# EAGLE design scan (EAGLE 7.6.0)
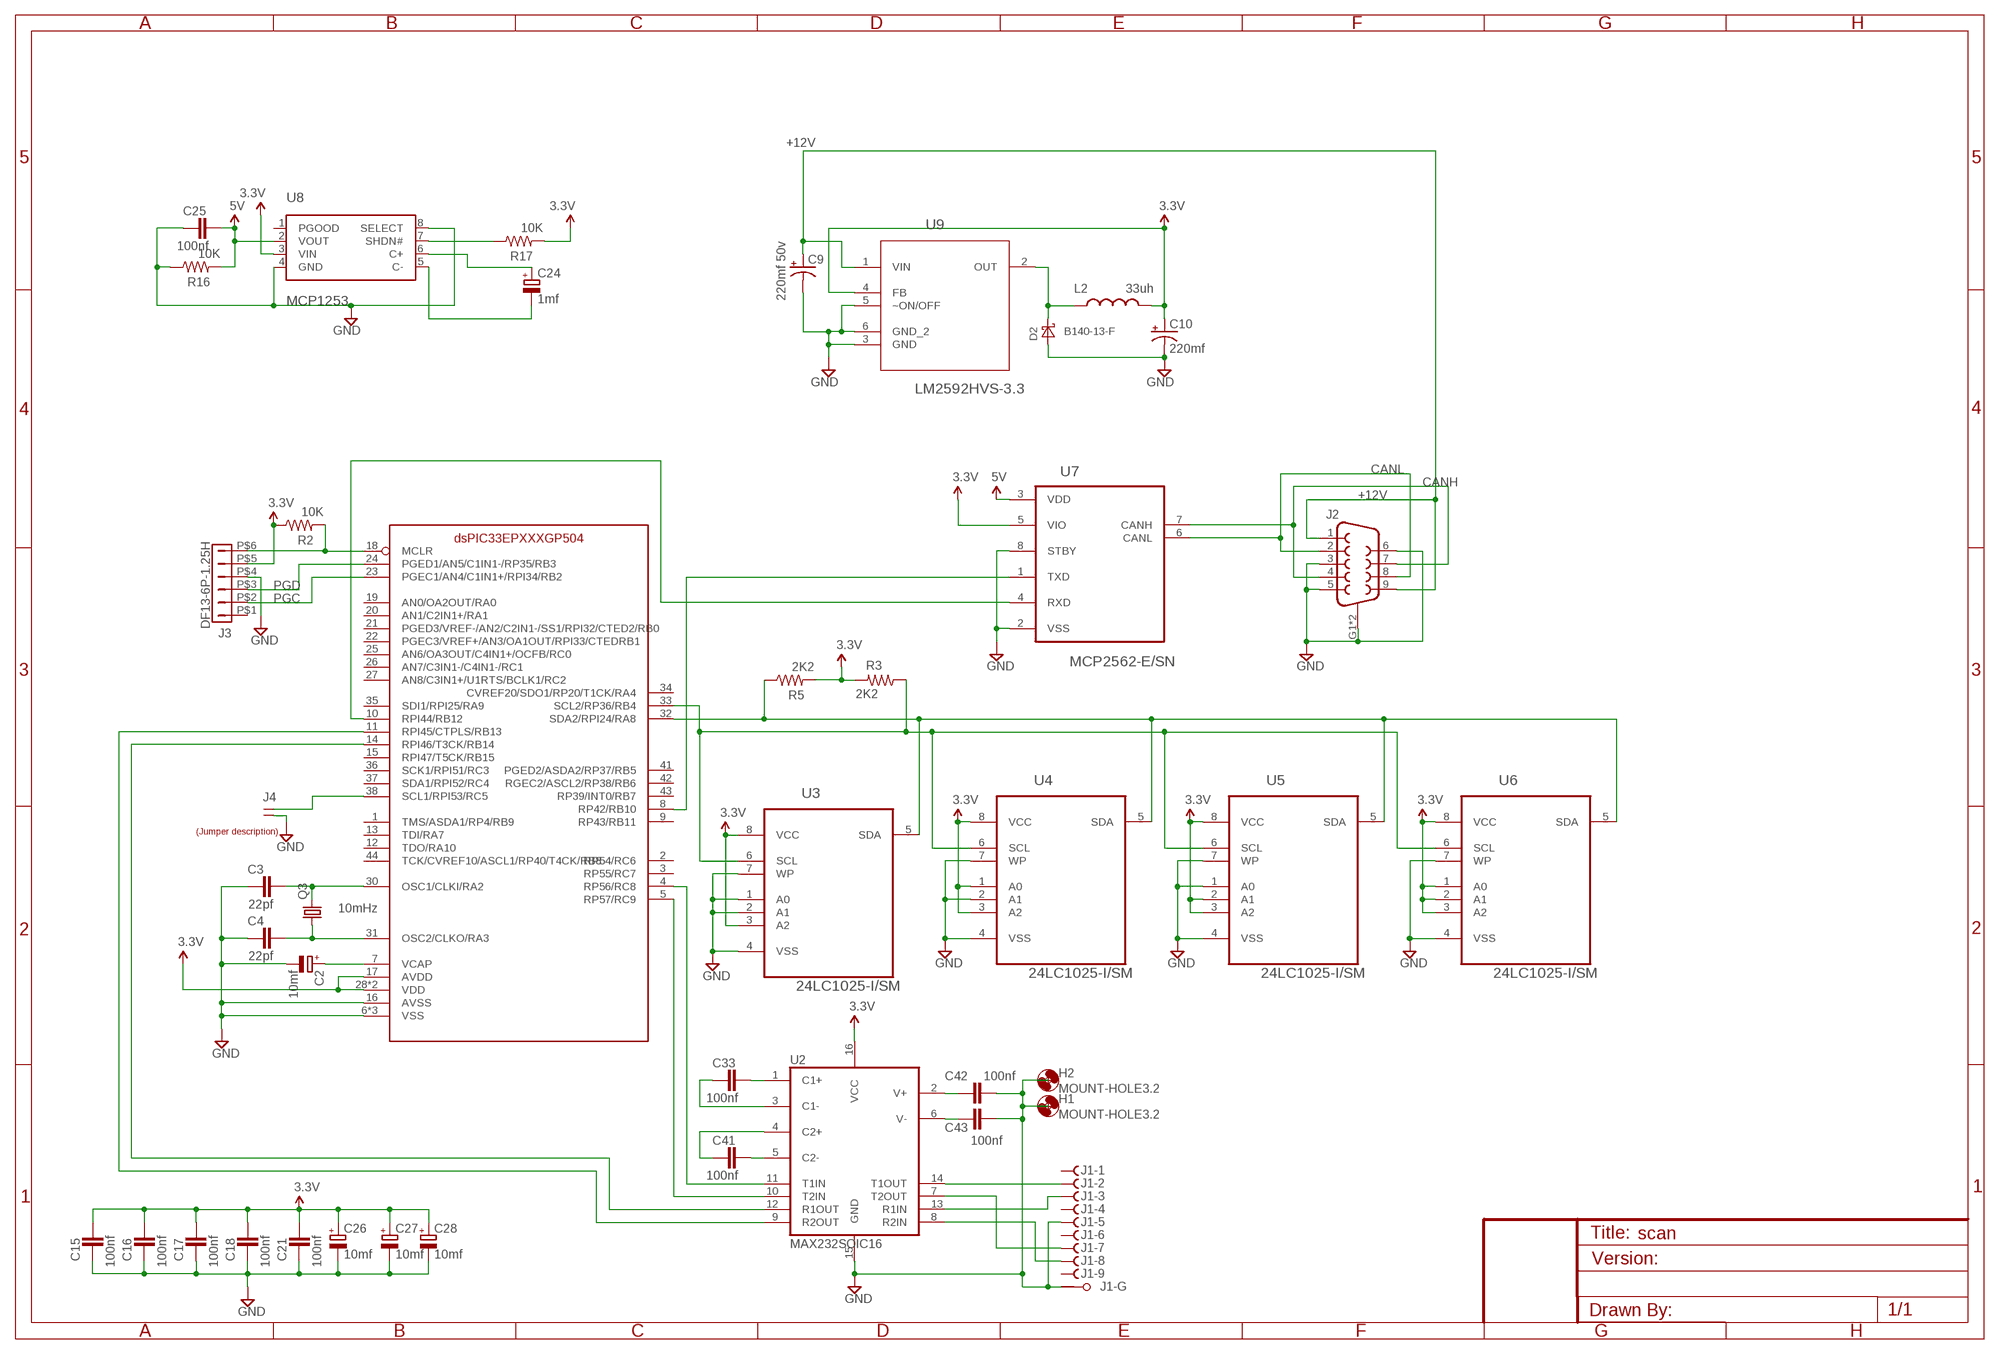
[diagram p0: schematic, sheet 1]

## Parts
C2  10mf  CAPACITOR_POL-SMC_A  [SMC_A]
C3  22pf  CAPACITOR_NPOL-0805  [C805]
C4  22pf  CAPACITOR_NPOL-0805  [C805]
C9  220mf 50v  CAP_POL7343  [EIA7343]
C10  220mf  CAP_POL7343  [EIA7343]
C15  100nf  CAPACITOR_NPOL-0805  [C805]
C16  100nf  CAPACITOR_NPOL-0805  [C805]
C17  100nf  CAPACITOR_NPOL-0805  [C805]
C18  100nf  CAPACITOR_NPOL-0805  [C805]
C21  100nf  CAPACITOR_NPOL-0805  [C805]
C24  1mf  CAPACITOR_POL-SMC_A  [SMC_A]
C25  100nf  CAPACITOR_NPOL-0805  [C805]
C26  10mf  CAPACITOR_POL-SMC_A  [SMC_A]
C27  10mf  CAPACITOR_POL-SMC_A  [SMC_A]
C28  10mf  CAPACITOR_POL-SMC_A  [SMC_A]
C33  100nf  CAPACITOR_NPOL-0805  [C805]
C41  100nf  CAPACITOR_NPOL-0805  [C805]
C42  100nf  CAPACITOR_NPOL-0805  [C805]
C43  100nf  CAPACITOR_NPOL-0805  [C805]
D2  B140-13-F  DIODE-SCHOTTKY-SMA  [SMA]
H1  MOUNT-HOLE3.2  [3,2]
H2  MOUNT-HOLE3.2  [3,2]
J1  F09VPS  [F09VP]
J2  DB9FEMALE  [DB9]
J3  DF13-6P-1.25H  [DF13A-6P-1.25H]
J4  JUMPER-1X2  [JUMPER-1X2]
L2  33uh  INDUCTOR  [1812]
Q3  10mHz  CRYSTALHC49S  [HC49/S]
R2  10K  RESISTOR0603-RES  [0603-RES]
R3  2K2  RESISTOR0603-RES  [0603-RES]
R5  2K2  RESISTOR0603-RES  [0603-RES]
R16  10K  RESISTOR0603-RES  [0603-RES]
R17  10K  RESISTOR0603-RES  [0603-RES]
U1  DSPIC33EPXXXGP504  [TQFP44]
U2  MAX232SOIC16  [SO016]
U3  24LC1025-I/SM  [SOIC8-N_MC]
U4  24LC1025-I/SM  [SOIC8-N_MC]
U5  24LC1025-I/SM  [SOIC8-N_MC]
U6  24LC1025-I/SM  [SOIC8-N_MC]
U7  MCP2562-E/SN  [SOIC-8N]
U8  MCP1253  [MSOP8]
U9  LM2592HVS-3.3  LM2592HVS-5.0  [TO170P1435X457-5N]
U$1  LABEL_JUMPER_1X2  [JUMP2_DESC]

## Nets
3.3V: C10.A(+) C15.1 C16.1 C17.1 C18.1 C21.1 C26.+ C27.+ C28.+ J3.P$5 L2.2 R2.1 R3.2 R5.2 R17.2 U1.17(AVDD) U1.28(VDD) U1.40(VDD) U2.16(VCC) U3.3(A2) U3.8(VCC) U4.1(A0) U4.3(A2) U4.8(VCC) U5.2(A1) U5.3(A2) U5.8(VCC) U6.1(A0) U6.2(A1) U6.3(A2) U6.8(VCC) U7.5(VIO) U8.3(VIN) U9.4(FB)
5V: C25.1 R16.2 U7.3(VDD) U8.2(VOUT)
!MCLR: J3.P$6 R2.2 U1.18(MCLR)
+12V [12v]: C9.A(+) J2.1 J2.9 U9.1(VIN)
CANH: J2.4 J2.7 U7.7(CANH)
CANL: J2.2 J2.8 U7.6(CANL)
GND: C2.- C3.2 C4.2 C9.C(-) C10.C(-) C15.2 C16.2 C17.2 C18.2 C21.2 C25.2 C26.- C27.- C28.- C42.1 C43.1 D2.A J1.5(-5:F) J1.G1(-G:G1) J2.3 J2.5 J2.6 J2.G1(SHIELD) J2.G2(SHIELD) J3.P$4 J4.2 R16.1 U1.6(VSS) U1.16(AVSS) U1.29(VSS) U1.39(VSS) U2.15(GND) U3.1(A0) U3.2(A1) U3.4(VSS) U3.7(WP) U4.2(A1) U4.4(VSS) U4.7(WP) U5.1(A0) U5.4(VSS) U5.7(WP) U6.4(VSS) U6.7(WP) U7.2(VSS) U7.8(STBY) U8.4(GND) U8.8(SELECT) U9.3(GND) U9.5(~ON/OFF) U9.6(GND_2)
N$1: J1.2(-2:F) U2.14(T1OUT)
N$2: U1.5(RP57/RC9) U2.10(T2IN)
N$3: U1.4(RP56/RC8) U2.11(T1IN)
N$4: J1.3(-3:F) U2.13(R1IN)
N$5: J1.8(-8:F) U2.8(R2IN)
N$6: J1.7(-7:F) U2.7(T2OUT)
N$7: U1.11(RPI45/CTPLS/RB13) U2.9(R2OUT)
N$8: U1.14(RPI46/T3CK/RB14) U2.12(R1OUT)
N$14: C33.1 U2.1(C1+)
N$18: C33.2 U2.3(C1-)
N$19: C3.1 Q3.2 U1.30(OSC1/CLKI/RA2)
N$21: C41.2 U2.4(C2+)
N$22: C41.1 U2.5(C2-)
N$23: D2.C L2.1 U9.2(OUT)
N$24: U1.10(RPI44/RB12) U7.4(RXD)
N$25: C2.+ U1.7(VCAP)
N$26: U1.8(RP42/RB10) U7.1(TXD)
N$27: C42.2 U2.2(V+)
N$28: C43.2 U2.6(V-)
N$30: J4.1 U1.38(SCL1/RPI53/RC5)
N$36: R17.1 U8.7(SHDN#)
N$37: C24.- U8.5(C-)
N$38: C24.+ U8.6(C+)
N$70: C4.1 Q3.1 U1.31(OSC2/CLKO/RA3)
PGC: J3.P$2 U1.23(PGEC1/AN4/C1IN1+/RPI34/RB2)
PGD: J3.P$3 U1.24(PGED1/AN5/C1IN1-/RP35/RB3)
SCL: R3.1 U1.33(SCL2/RP36/RB4) U3.6(SCL) U4.6(SCL) U5.6(SCL) U6.6(SCL)
SDA: R5.1 U1.32(SDA2/RPI24/RA8) U3.5(SDA) U4.5(SDA) U5.5(SDA) U6.5(SDA)
Unconnected: J1.1(-1:F) J1.4(-4:F) J1.6(-6:F) J1.9(-9:F) J1.G2(-G:G2) J3.P$1 U1.1(TMS/ASDA1/RP4/RB9) U1.2(RP54/RC6) U1.3(RP55/RC7) U1.9(RP43/RB11) U1.12(TDO/RA10) U1.13(TDI/RA7) U1.15(RPI47/T5CK/RB15) U1.19(AN0/OA2OUT/RA0) U1.20(AN1/C2IN1+/RA1) U1.21(PGED3/VREF-/AN2/C2IN1-/SS1/RPI32/CTED2/RB0) U1.22(PGEC3/VREF+/AN3/OA1OUT/RPI33/CTEDRB1) U1.25(AN6/OA3OUT/C4IN1+/OCFB/RC0) U1.26(AN7/C3IN1-/C4IN1-/RC1) U1.27(AN8/C3IN1+/U1RTS/BCLK1/RC2) U1.34(CVREF20/SDO1/RP20/T1CK/RA4) U1.35(SDI1/RPI25/RA9) U1.36(SCK1/RPI51/RC3) U1.37(SDA1/RPI52/RC4) U1.41(PGED2/ASDA2/RP37/RB5) U1.42(RGEC2/ASCL2/RP38/RB6) U1.43(RP39/INT0/RB7) U1.44(TCK/CVREF10/ASCL1/RP40/T4CK/RB8) U8.1(PGOOD)

## Library data of the parts
C2 C26-C28 = dp_devices:CAPACITOR_POL: Polarized capacitor in various packages; PARTNO: T491A106K004AT
C3 C4 = dp_devices:CAPACITOR_NPOL: Non-Polarized capacitor in various packages; PARTNO: C0805C220J5GACTU
C9 C10 = SparkFun:CAP_POL: Capacitor Polarized These are standard SMD and PTH capacitors. Normally 10uF, 47uF, and 100uF in electrolytic and tantalum varieties. Always verify the external diameter of the through hole cap, it varies with capacity, voltage, and manufacturer. The EIA devices should be standard.; PARTNO: T545X227M016ATE035
C15-C18 C21 C25 C33 C41-C43 = dp_devices:CAPACITOR_NPOL: Non-Polarized capacitor in various packages; PARTNO: CL21F104ZBCNNNC
C24 = dp_devices:CAPACITOR_POL: Polarized capacitor in various packages; PARTNO: F931C105MAA
D2 = diode2:DIODE-SCHOTTKY-: SCHOTTKY DIODE; PARTNO: B140-13-F
H1 H2 = holes:MOUNT-HOLE: MOUNTING HOLE with drill center marker
J1 = con-subd:F09VPS: SUB-D; OC_FARNELL: unknown; OC_NEWARK: unknown; PARTNO: 3-1634222-2
J2 = 15pinD:DB9: DB9 Connector Standard DB9 (D-Sub 9) serial connector. Can be used for CAN bus as well as RS485 and RS232. Footprint production proven. Spark Fun Electronics SKU : PRT-00429; PARTNO: 1734354-2; PROD_ID: CONN-08194
J3 = con-hirose-df13:DF13-6P-1.25: DF13-6P 1.25mm Pitch Miniature Crimping Connector.; PARTNO: DF13A-6P-1.25H(20)
J4 = QuantumOptics:JUMPER-1X2: Jumper, header, SIP on 0.1" grid, for option selection.; PARTNO: M20-9770246
L2 = SparkFun:INDUCTOR: Inductors Basic Inductor/Choke - 0603 and 1206. Footprints are not proven and vary greatly between part numbers.; PARTNO: LQH43MN330K03L
Q3 = crystal:CRYSTAL: CRYSTAL; OC_FARNELL: 1667008; OC_NEWARK: unknown; PARTNO: ATS100B-E
R2 R16 R17 = SparkFun-Passives:RESISTOR: Resistor Basic schematic elements and footprints for 0603, 1206, and PTH resistors.; PARTNO: RC0603FR-0710KL
R3 R5 = SparkFun-Passives:RESISTOR: Resistor Basic schematic elements and footprints for 0603, 1206, and PTH resistors.; PARTNO: RC0603FR-072K2L
U1 = microchip-dspic:DSPIC33EPXXXGP504; PARTNO: DSPIC33EP512GP504-I/PT
U2 = SparkFun:MAX232: RS232 Transceiver Very common IC. This is generically called 'MAX232', but works with the 3V equivalent MAX3232 generic ICs. Field tested and mother approved. Spark Fun Electronics SKU : COM-00316 (DIP) and COM-00589 (SMD); PARTNO: MAX3232ECDR
U3-U6 = Microchip_By_element14_Batch_1:24LC1025-I/SM: 1024K I2C CMOS Serial EEPROM; PARTNO: 24LC1025T-I/SN
U7 = Microchip-MCP2562-E_SN:MCP2562-E/SN: High-Speed CAN Transceiver,SOIC-8; PARTNO: MCP2562-E/SN
U8 = microchip-dspic:MCP1253: Positive-Regulated Charge Pump (3.3x5.0); PARTNO: MCP1253-33X50I/MS
U9 = NSC_By_element14_Batch_1.1:LM2592HVS-5.0: SIMPLE SWITCHER; MPN: LM2592HVS-5.0; OC_FARNELL: -; OC_NEWARK: 41K3791; PACKAGE: TO-263-5; PARTNO: LM2592HVSX-3.3/NOPB; SUPPLIER: National Semiconductor
U$1 = dp_devices:LABEL_JUMPER_1X2: Nice formatted two legged jumperdescription Use attributes to change the values ON = With jumper OFF = Without jumper; OFF: Normal; ON: Reset

## Net classes
2 12v: width 0.152 mm, drill 0.305 mm, clearance 0.305 mm

## Board
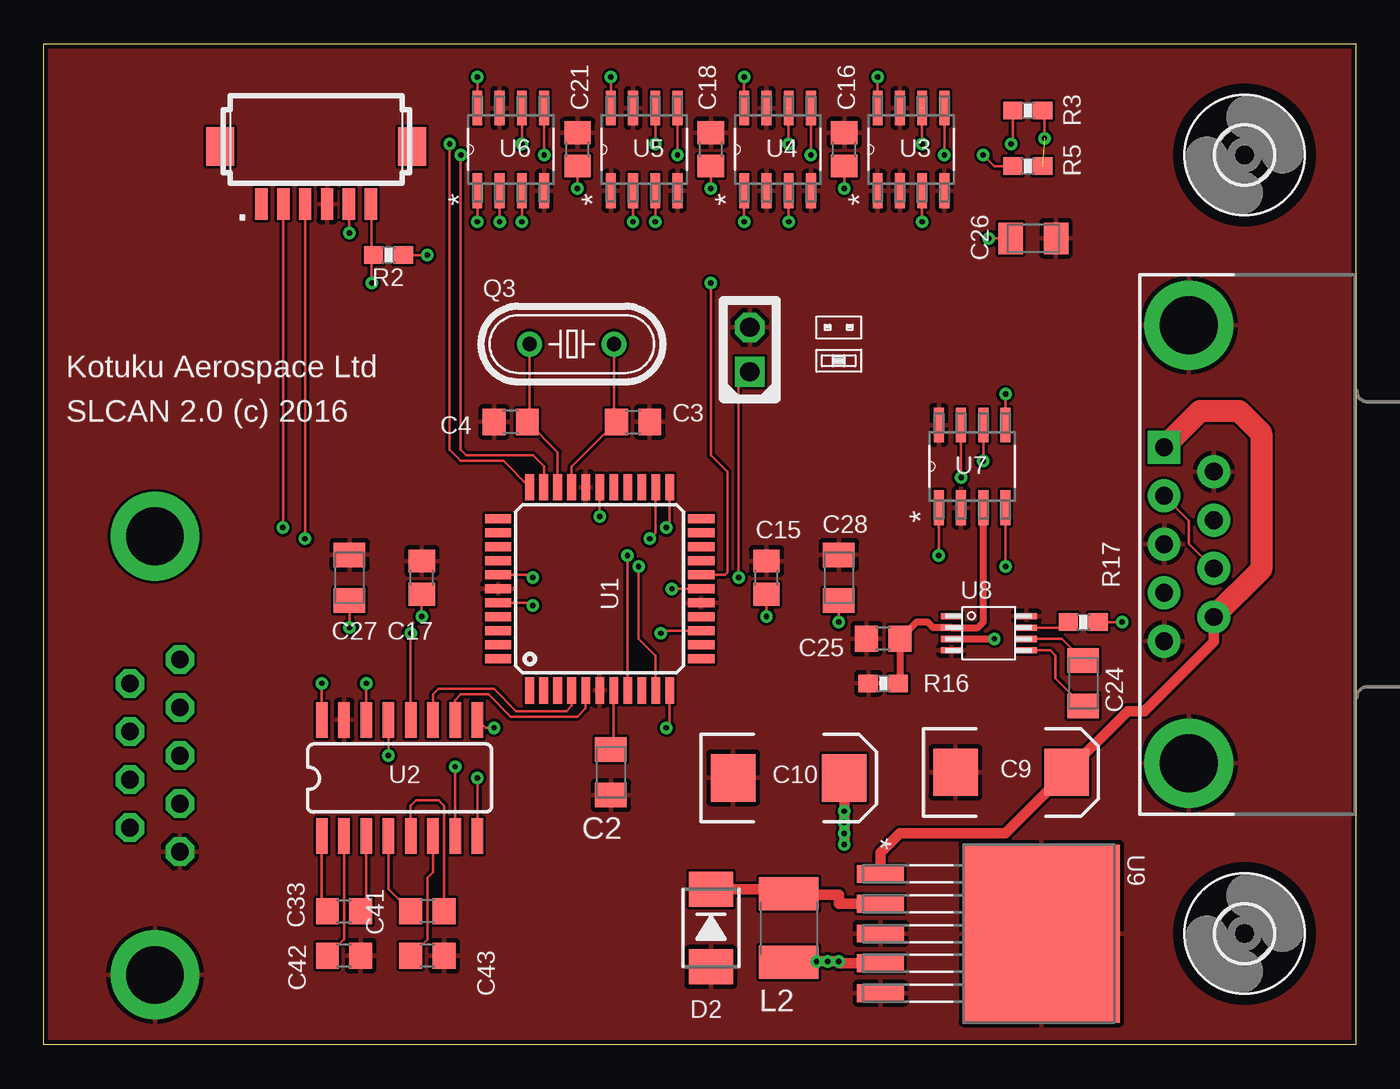
[diagram p1: board, top side]
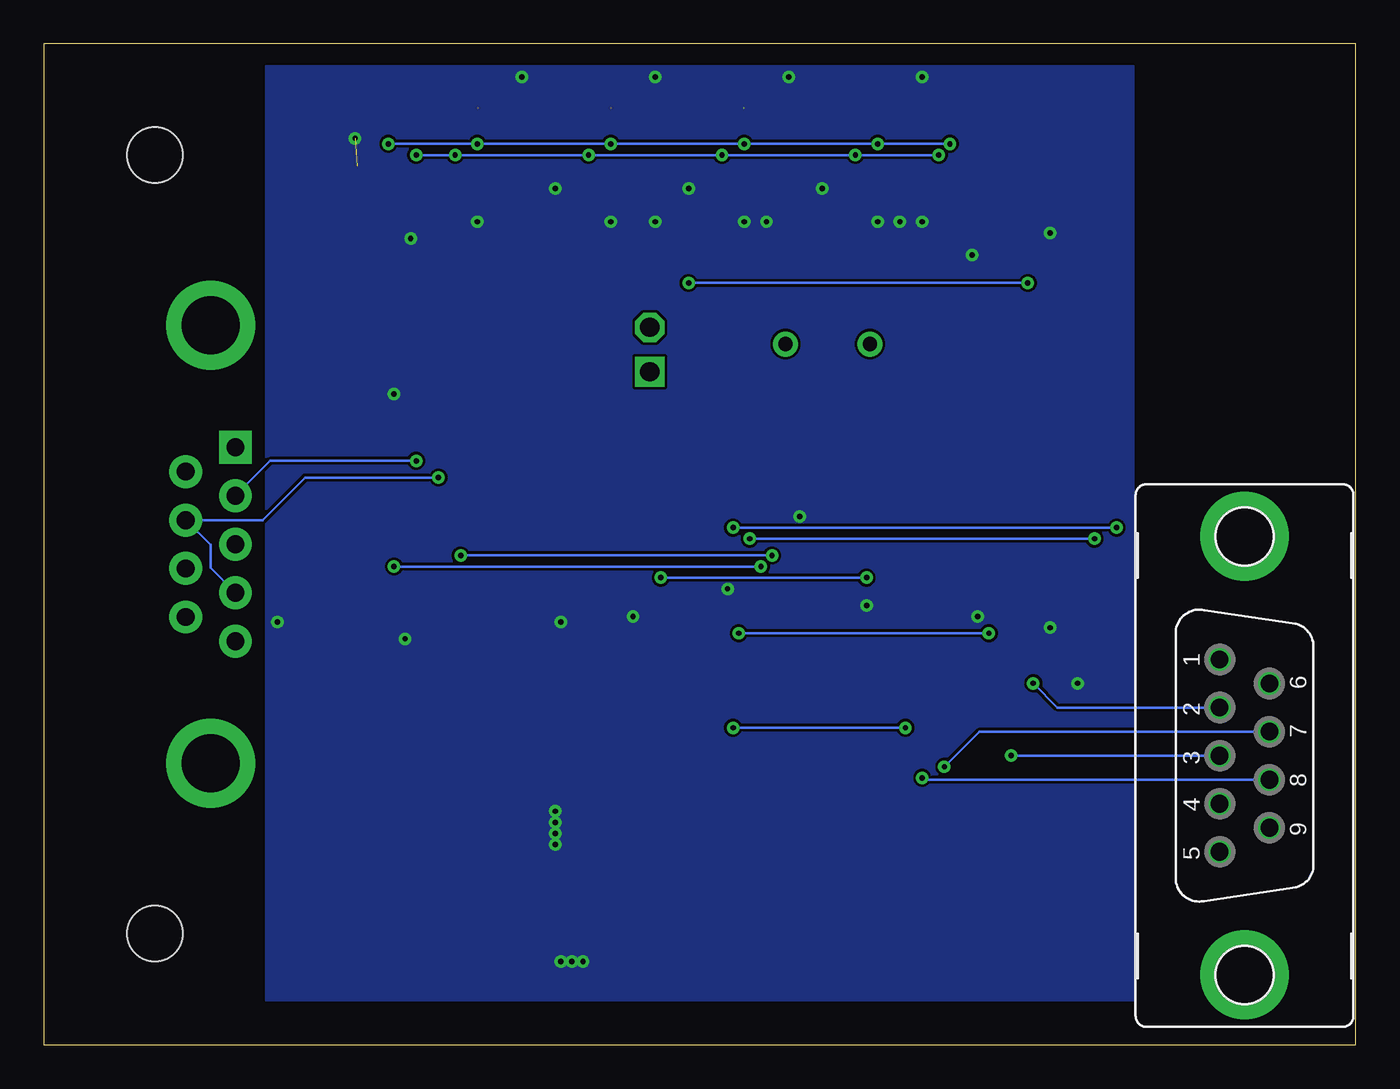
[diagram p2: board, bottom side, seen from below]

Size 74.93 x 57.15 mm. Coordinates in mm from the lower left corner, seen from the top.
Outline: 0,0 0,57.15 74.93,57.15 74.93,0 0,0
Copper layers (1*16): Top 0.035mm / dielectric 1.5mm / Bottom 0.035mm
Design rules "DFRobot_Eagle_Rule_v0.4": minimum track width 6mil, minimum drill 12mil, track to track 6mil, track to pad 6mil, pad to pad 6mil, via to via 6mil, smd to smd 0mil, copper to edge 10mil, drill to drill 10mil, minimum pad ring 12mil, minimum via ring 8mil, stop-mask expansion 2mil, vias tented up to drill 25mil, thermal gap 10mil

### Footprints (pad centres in the part's own frame; a part is rotated, then mirrored left to right if it is on the bottom)
SMC_A = smd 1.4 x 1.8: + -1.3,0; - 1.3,0
C805 = smd 1.3 x 1.5: 1 -0.95,0; 2 0.95,0
EIA7343 = smd 2.55 x 2.7: A 3.17,0; C -3.17,0
SMA = smd 2 x 2.5: A 2.223,0; C -2.223,0
3,2 = hole 3.2: 0,0
F09VP = drill 1.016 octagon: 1 5.486,1.422; 2 2.743,1.422; 3 0,1.422; 4 -2.743,1.422; 5 -5.486,1.422; 6 4.115,-1.422; 7 1.372,-1.422; 8 -1.372,-1.422; 9 -4.115,-1.422 | drill 3.302 pad 5.08: G1 -12.522,0; G2 12.522,0
DB9 = drill 1.016 pad 1.88 square: 1 -5.54,-1.42 | drill 1.016 pad 1.88: 2 -2.77,-1.42; 3 0,-1.42; 4 2.77,-1.42; 5 5.54,-1.42; 6 -4.15,1.42; 7 -1.38,1.42; 8 1.38,1.42; 9 4.15,1.42 | drill 3.302 pad 5.08: G1 -12.5,0; G2 12.5,0
DF13A-6P-1.25H = smd 1.6 x 2.2: M$0 -5.475,2.4; M$1 5.475,2.4 | smd 0.7 x 1.8: P$1 -3.125,-0.9; P$2 -1.875,-0.9; P$3 -0.625,-0.9; P$4 0.625,-0.9; P$5 1.875,-0.9; P$6 3.125,-0.9
JUMPER-1X2 = drill 1.092 square: 1 0,2.54 | drill 1.092 octagon: 2 0,0
1812 = smd 1.9 x 3.4: 1 -1.95,0; 2 1.95,0
HC49/S = drill 0.813: 1 -2.413,0; 2 2.413,0
0603-RES = smd 1.1 x 1: 1 -0.85,0; 2 0.85,0
TQFP44 = smd 1.5 x 0.5: 1 -5.8,4; 2 -5.8,3.2; 3 -5.8,2.4; 4 -5.8,1.6; 5 -5.8,0.8; 6 -5.8,0; 7 -5.8,-0.8; 8 -5.8,-1.6; 9 -5.8,-2.4; 10 -5.8,-3.2; 11 -5.8,-4; 23 5.8,-4; 24 5.8,-3.2; 25 5.8,-2.4; 26 5.8,-1.6; 27 5.8,-0.8; 28 5.8,0; 29 5.8,0.8; 30 5.8,1.6; 31 5.8,2.4; 32 5.8,3.2; 33 5.8,4 | smd 0.5 x 1.5: 12 -4,-5.8; 13 -3.2,-5.8; 14 -2.4,-5.8; 15 -1.6,-5.8; 16 -0.8,-5.8; 17 0,-5.8; 18 0.8,-5.8; 19 1.6,-5.8; 20 2.4,-5.8; 21 3.2,-5.8; 22 4,-5.8; 34 4,5.8; 35 3.2,5.8; 36 2.4,5.8; 37 1.6,5.8; 38 0.8,5.8; 39 0,5.8; 40 -0.8,5.8; 41 -1.6,5.8; 42 -2.4,5.8; 43 -3.2,5.8; 44 -4,5.8
SO016 = smd 0.66 x 2.032: 1 -4.445,-3.315; 2 -3.175,-3.315; 3 -1.905,-3.315; 4 -0.635,-3.315; 5 0.635,-3.315; 6 1.905,-3.315; 7 3.175,-3.315; 8 4.445,-3.315; 9 4.445,3.315; 10 3.175,3.315; 11 1.905,3.315; 12 0.635,3.315; 13 -0.635,3.315; 14 -1.905,3.315; 15 -3.175,3.315; 16 -4.445,3.315
SOIC8-N_MC = smd 1.981 x 0.559: 1 -2.362,1.905; 2 -2.362,0.635; 3 -2.362,-0.635; 4 -2.362,-1.905; 5 2.362,-1.905; 6 2.362,-0.635; 7 2.362,0.635; 8 2.362,1.905
SOIC-8N = smd 1.981 x 0.559: 1 1.448,5.715; 2 1.448,4.445; 3 1.448,3.175; 4 1.448,1.905; 5 6.172,1.905; 6 6.172,3.175; 7 6.172,4.445; 8 6.172,5.715
MSOP8 = smd 1.2 x 0.35: 1 -2.145,0.975; 2 -2.145,0.325; 3 -2.145,-0.325; 4 -2.145,-0.975; 5 2.145,-0.975; 6 2.145,-0.325; 7 2.145,0.325; 8 2.145,0.975
TO170P1435X457-5N = smd 1.016 x 2.692: 1 -3.404,-9.042; 2 -1.702,-9.042; 3 0,-9.042; 4 1.702,-9.042; 5 3.404,-9.042 | smd 10.16 x 8.941: 6 0,0.152

### Placement (x,y rotation side)
C2  32.38,15.56 270 top
C3  33.66,35.56 0 top
C4  26.67,35.56 180 top
C9  55.24,15.56 0 top
C10  42.55,15.24 0 top
C15  41.27,26.67 90 top
C16  45.72,51.12 90 top
C17  21.59,26.67 90 top
C18  38.1,51.12 90 top
C21  30.48,51.12 90 top
C24  59.37,20.64 270 top
C25  47.94,23.18 180 top
C26  56.52,46.04 0 top
C27  17.46,26.67 90 top
C28  45.4,26.67 90 top
C33  17.14,7.62 0 top
C41  21.91,7.62 180 top
C42  17.14,5.08 180 top
C43  21.91,5.08 180 top
D2  38.1,6.67 270 top
H1  68.58,50.8 0 top
H2  68.58,6.35 0 top
J1  6.35,16.51 90 bottom
J2  65.41,28.57 270 top
J3  15.56,48.9 0 top
J4  40.32,40.96 180 top
L2  42.55,6.67 270 top
Q3  30.16,40.01 0 top
R2  19.68,45.09 180 top
R3  56.2,53.34 0 top
R5  56.2,50.16 0 top
R16  47.94,20.64 0 top
R17  59.37,24.13 0 top
U1  31.75,26.04 90 top
U2  20.32,15.24 0 top
U3  49.53,51.12 90 top
U4  41.91,51.12 90 top
U5  34.29,51.12 90 top
U6  26.67,51.12 90 top
U7  56.83,29.21 90 top
U8  53.98,23.5 0 top
U9  56.83,6.35 270 top
U$1  47.94,39.69 0 top

### Tracks (layer width: path | path; a pad name or v marks a point on that pad's centre or on a via)
3.3V  (via drill 0.3)  (1 unrouted)
  Top 0.152: U1.40 27.94,25.23 v27.94,25.08 | U1.28 v31.75,30.16 | U1.17 v35.88,26.04 | C17.1 v21.59,24.45 | C27.+ v17.46,23.81 | U2.16 v15.88,20.64 | C15.1 v41.27,24.45 | C28.+ v45.4,24.13 | U6.8 v24.77,55.24 | U6.1 v24.77,46.99 | U6.2 v26.04,46.99 | U6.3 v27.3,46.99 | C21.1 v30.48,48.9 | U5.8 v32.38,55.24 | U5.2 v33.66,46.99 | U5.3 v34.92,46.99 | C18.1 v38.1,48.9 | U4.1 v40.01,46.99 | U4.8 v40.01,55.24 | U4.3 v42.55,46.99 | C16.1 v45.72,48.9 | U3.8 v47.62,55.24 | U3.3 v50.16,46.99 | R3.2 57.15,53.24 v57.15,51.75 | R5.2 57.15,50.16 | C26.+ v53.98,46.04 | U7.5 v54.93,37.15 | R17.2 v61.59,24.13 | U8.3 | R2.1 v21.91,45.09 | J3.P$5 17.43,46.38 v17.46,46.35
  Top 0.406: U8.3 v54.29,23.18
  Top 0.61: U9.4 45.4,4.65 v45.4,4.76 v44.77,4.76 v44.13,4.76 42.55,4.76 L2.2 | C10.A v45.72,13.34 v45.72,12.7 v45.72,12.06 v45.72,11.43
  pour Bottom: 12.7,55.88 62.23,55.88 62.23,2.54 12.7,2.54
5V
  Top 0.406: U7.3 53.66,24.13 53.35,23.82 U8.2 51.12,23.82 51.12,23.81 50.8,23.81 50.48,24.13 49.84,24.13 C25.1 48.89,20.74 R16.2
!MCLR  (via drill 0.3)
  Top 0.152: U1.18 38.9,26.84 39.05,26.99 39.05,32.7 38.1,33.66 v38.1,43.5 | v18.73,43.5 18.73,44.98 R2.2 18.73,45.19 18.73,47.94 J3.P$6
  Bottom 0.152: v38.1,43.5 v18.73,43.5
+12V
  Top 0.61: U9.1 47.79,10.96 48.9,12.06 54.92,12.06 C9.A 61.91,19.05 62.87,19.05 66.83,23.01 J2.9
  Top 1.27: J2.1 63.98,34.14 66.04,36.2 68.26,36.2 69.53,34.92 69.53,27.13 J2.9
CANH  (via drill 0.3)
  Top 0.152: U7.7 v52.39,32.38
  Bottom 0.152: J2.4 65.41,27.23 65.41,28.54 J2.7 62.44,29.95 60.01,32.38 v52.39,32.38
CANL  (via drill 0.3)
  Top 0.152: J2.2 65.41,29.93 65.41,28.61 J2.8 | U7.6 v53.66,33.34
  Bottom 0.152: v53.66,33.34 61.99,33.34 J2.2
GND
  pour Top: 0,57.15 74.93,57.15 74.93,0 0,0
N$1  (via drill 0.3)
  Top 0.152: v18.41,20.64 U2.14
  Bottom 0.152: J1.2 17.03,19.25 v18.41,20.64
N$2
  Top 0.152: U2.10 23.5,19.68 23.81,20 25.4,20 26.67,18.73 30.48,18.73 30.95,19.2 U1.5
N$3
  Top 0.152: U2.11 22.23,20 22.54,20.32 25.72,20.32 26.99,19.05 29.84,19.05 30.15,19.36 U1.4
N$4  (via drill 0.3)
  Top 0.152: v19.68,16.51 U2.13
  Bottom 0.152: J1.3 v19.68,16.51
N$5  (via drill 0.3)
  Top 0.152: v24.77,15.24 U2.8
  Bottom 0.152: J1.8 24.66,15.14 v24.77,15.24
N$6  (via drill 0.3)
  Top 0.152: v23.5,15.88 U2.7
  Bottom 0.152: J1.7 21.49,17.88 v23.5,15.88
N$7  (via drill 0.3)
  Top 0.152: U2.9 25.22,18.1 v25.72,18.1 | v35.56,18.1 35.75,18.29 U1.11
  Bottom 0.152: v25.72,18.1 v35.56,18.1
N$8  (via drill 0.3)
  Top 0.152: U2.12 v20.95,23.5 | v35.24,23.5 35.38,23.64 U1.14
  Bottom 0.152: v20.95,23.5 v35.24,23.5
N$14
  Top 0.152: U2.1 15.88,7.94 C33.1
N$18
  Top 0.152: U2.3 18.41,7.94 C33.2
N$19
  Top 0.152: Q3.2 32.58,35.69 C3.1 30.15,33.01 U1.30
N$21
  Top 0.152: U2.4 19.68,8.89 C41.2
N$22
  Top 0.152: U2.5 20.95,13.65 21.27,13.97 22.54,13.97 22.86,13.65 C41.1
N$23
  Top 0.61: U9.2 45.4,8.05 45.4,8.57 42.55,8.57 L2.1 42.55,8.89 D2.C
N$24  (via drill 0.3)
  Top 0.152: U1.10 34.95,22.2 33.97,23.18 v33.97,27.3 | v54.93,27.3 U7.4
  Bottom 0.152: v33.97,27.3 v54.93,27.3
N$25
  Top 0.152: C2.+ 32.55,17.02 U1.7
N$26  (via drill 0.3)
  Top 0.152: U1.8 33.35,27.93 v33.34,27.94 | v51.12,27.94 U7.1
  Bottom 0.152: v33.34,27.94 v51.12,27.94
N$27
  Top 0.152: U2.2 17.14,6.03 C42.2
N$28
  Top 0.152: U2.6 22.23,9.84 21.91,9.53 21.91,6.03 C43.2
N$30  (via drill 0.3)
  Top 0.152: U1.38 27.77,26.84 v27.94,26.67 | v39.69,26.67 39.69,37.78 J4.1
  Bottom 0.152: v27.94,26.67 v39.69,26.67
N$36
  Top 0.152: U8.7 58.21,23.82 R17.1
N$37
  Top 0.152: U8.5 57.49,22.52 57.78,22.23 57.78,20.93 C24.-
N$38
  Top 0.152: U8.6 58.14,23.17 C24.+
N$70
  Top 0.152: Q3.1 27.75,35.69 C4.1 29.35,33.83 U1.31
PGC  (via drill 0.3)
  Top 0.152: J3.P$2 13.68,29.56 v13.65,29.53 | v35.56,29.53 35.75,29.72 U1.23
  Bottom 0.152: v13.65,29.53 v35.56,29.53
PGD  (via drill 0.3)
  Top 0.152: J3.P$3 14.93,28.9 v14.92,28.89 | v34.61,28.89 34.95,29.23 U1.24
  Bottom 0.152: v14.92,28.89 v34.61,28.89
SCL  (via drill 0.3)  (3 unrouted)
  Top 0.152: U1.33 26.25,33.34 23.81,33.34 23.18,33.97 v23.18,51.44 | v55.24,51.44 55.35,51.54 R3.1 | U6.6 v27.3,51.44 | 34.92,53.5 v34.92,51.44 | 42.55,53.5 v42.55,51.44 | 50.16,53.5 v50.16,51.44
  Bottom 0.152: v23.18,51.44 v27.3,51.44 v34.92,51.44 v42.55,51.44 v50.16,51.44 v55.24,51.44
SDA  (via drill 0.3)
  Top 0.152: U1.32 28.57,31.86 28.57,33.02 27.94,33.66 24.13,33.66 23.81,33.97 v23.81,50.8 | v53.66,50.8 54.29,50.16 R5.1 | U3.5 v51.44,50.8 | U4.5 v43.81,50.8 | U5.5 v36.2,50.8 | U6.5 v28.57,50.8
  Bottom 0.152: v23.81,50.8 v28.57,50.8 v36.2,50.8 v43.81,50.8 v51.44,50.8 v53.66,50.8

### Text on the board
tPlace: Kotuku Aerospace Ltd | SLCAN 2.0 (c) 2016